# EAGLE design Arduino CAN Dev Board (EAGLE 6.4)
DESCRIPTION: microOBD 200 OBD-II Module; HW_REV: 1.4; PCB_REV: C; PCB_SPEC1: Layer Count: 4; PCB_SPEC2: Size: 1.3" x 0.59"; PCB_SPEC3: Finish Thickness: 0.049" - 0.052"; PCB_SPEC4: Copper Weight: 1oz; TITLE: STM1120

## Sheet 1 of 2
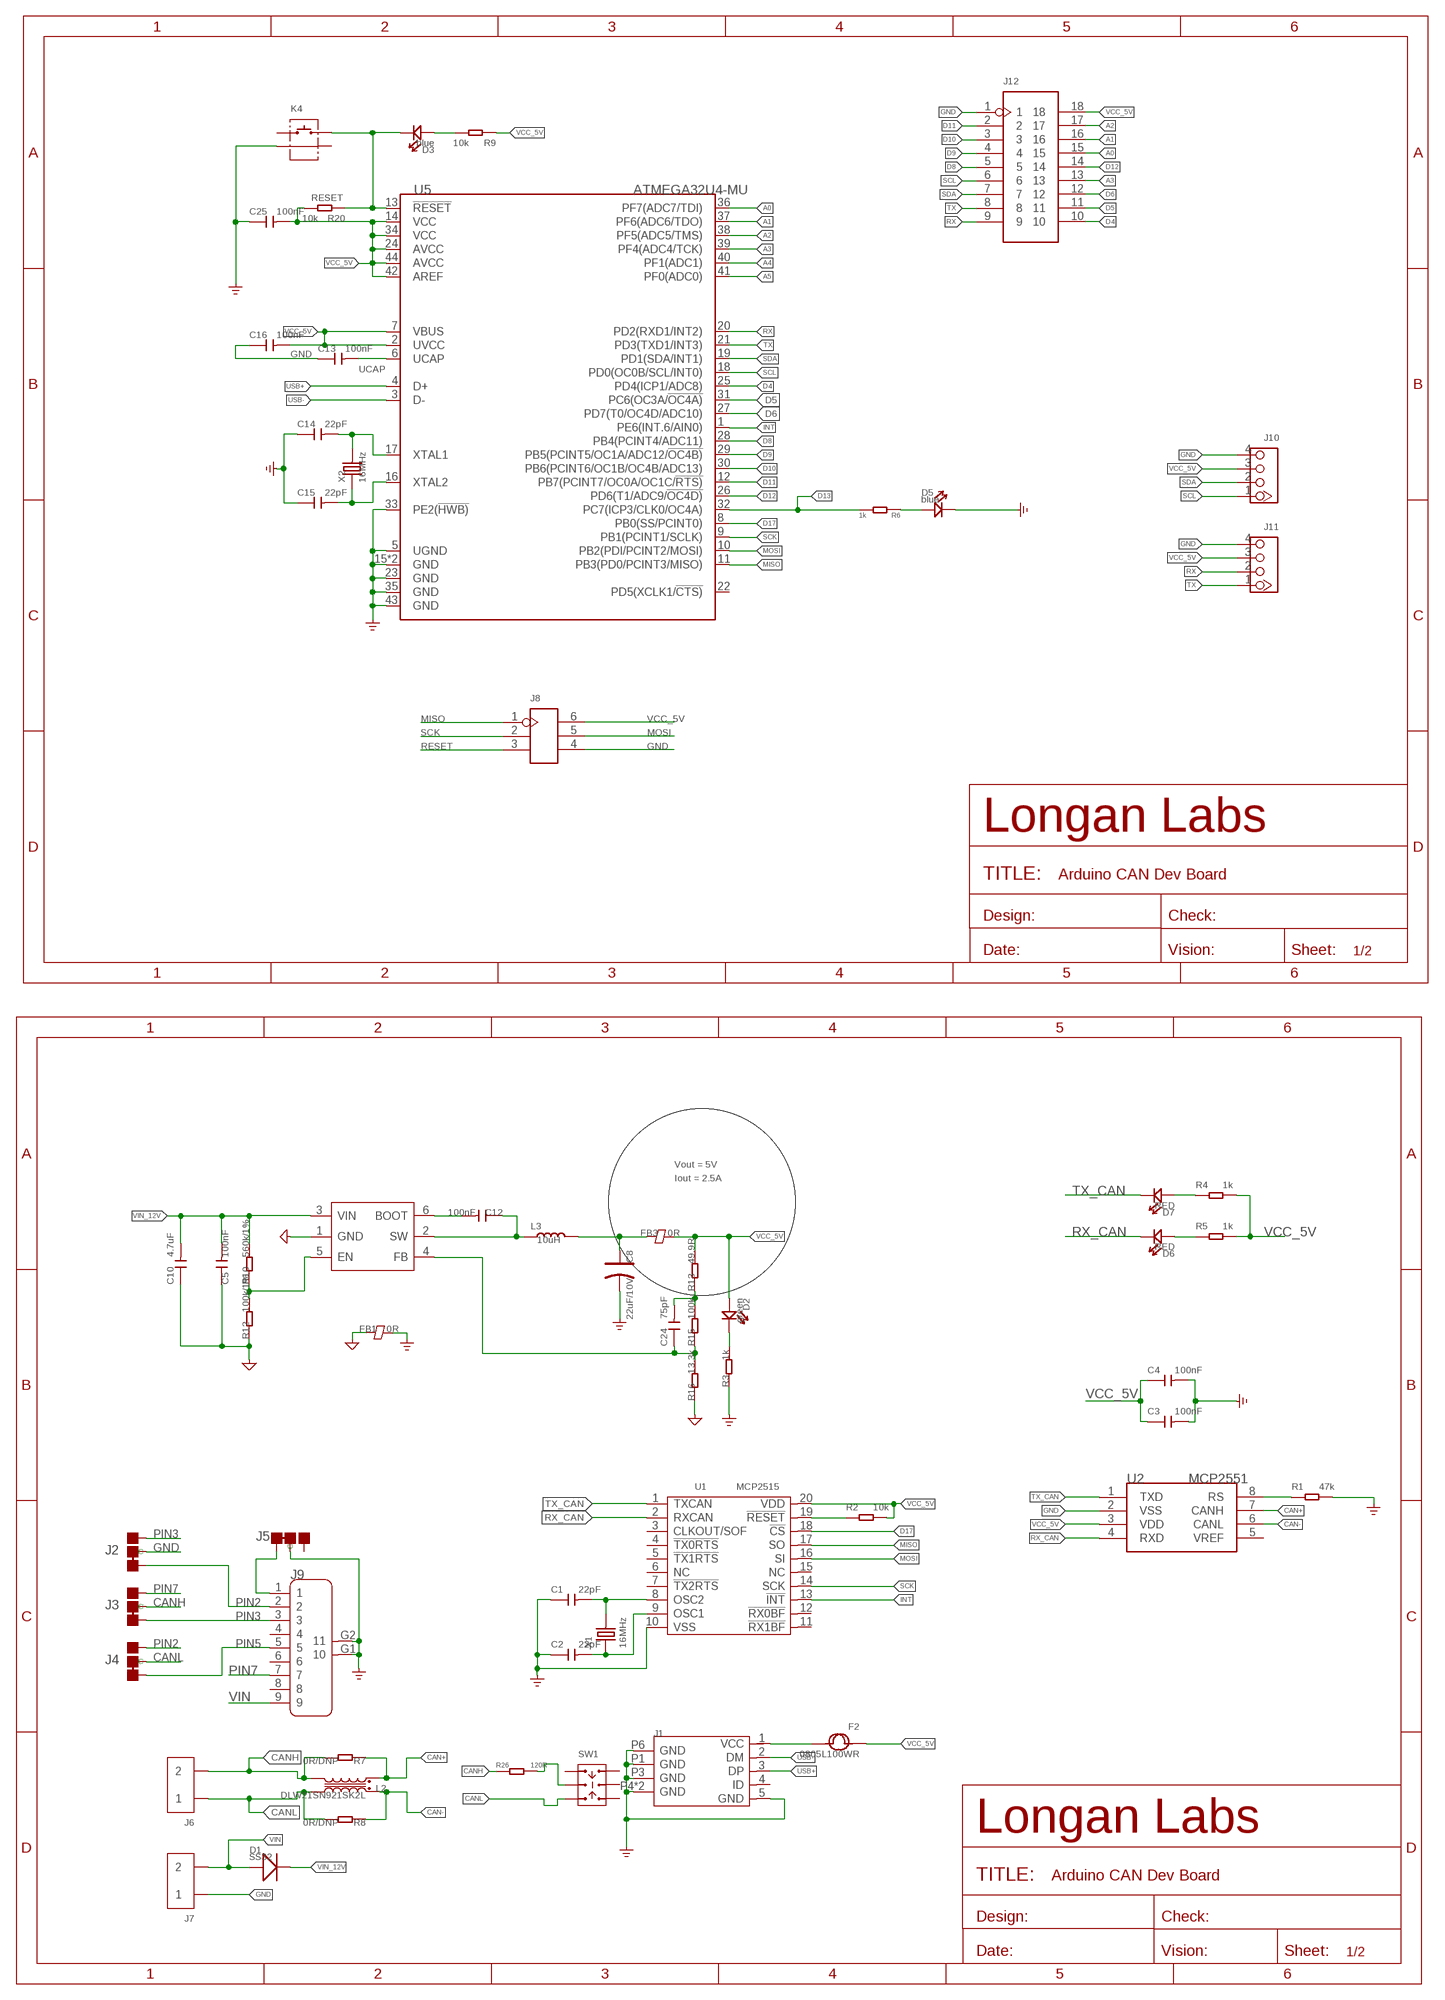
[diagram p0: schematic, sheet 1]

### Parts
C1  22pF  CAP-0603  [C0603]
C2  22pF  CAP-0603  [C0603]
C3  100nF  CAP-0603  [C0603]
C4  100nF  CAP-0603  [C0603]
C5  100nF  CAP-0603  [C0603]
C8  22uF/10V  CAP-POLAR-AVX-B  [AVX-B]
C10  4.7uF  CAP-1206  [C1206]
C12  100nF  CAP-0603  [C0603]
C13  100nF  CAP-0603  [C0603]
C14  22pF  CAP-0603  [C0603]
C15  22pF  CAP-0603  [C0603]
C16  100nF  CAP-0603  [C0603]
C24  75pF  CAP-0603  [C0603]
C25  100nF  CAP-0603  [C0603]
D1  SS32  DIODE'SMA'  [DO-214AC]
D2  green  LED'0603'  [LED-0603]
D3  blue  LED'0603'  [LED-0603]
D5  blue  LED'0603'  [LED-0603]
D6  RED  LED'0603'  [LED-0603]
D7  RED  LED'0603'  [LED-0603]
F2  0805L100WR  FUSE0805  [F0805]
FB1  0R  FERRITE-BEAD-0805  [F0805]
FB3  0R  FERRITE-BEAD-0805  [F0805]
J1  MICRO-USB5+4P-320010050  [MICRO-USB5+5P-SMD-0.65-7.2X5.06MM]
J2  JUMPER-3P-SHORT  [3P-SMD-SHORT]
J3  JUMPER-3P-SHORT  [3P-SMD-SHORT]
J4  JUMPER-3P-SHORT  [3P-SMD-SHORT]
J5  JUMPER-3P-SHORT  [3P-SMD-SHORT]
J6  SCREW-TERMINAL-2P'5.08'  [H2-5.0-10.5X8.0MM]
J7  SCREW-TERMINAL-2P'5.08'  [H2-5.0-10.5X8.0MM]
J8  HEADER-2X3P-2.54  [H2X3-2.54]
J9  DB9'MEAL'  [DB9-MEAL]
J10  320110033  GROVE-CONNECTOR-DIP-2.0  [HW4-2.0]
J11  320110033  GROVE-CONNECTOR-DIP-2.0  [HW4-2.0]
J12  HEADER-2X9P-2.54  [H2X9-2.54]
K4  BUTTON-2+2P  [SW2+2P-7.7X2.75X3.95MM]
L2  DLW21SN921SK2L  INDUCTOR-COMMON-MODE-SRF2012-900YA  [INT4-0.85-2X1.25X1.2MM]
L3  10uH  INDUCTOR-6.6X7.1  [INT2-SMD-6.6X7.1X3MM]
R1  47k  RES-0603  [R0603]
R2  10k  RES-0603  [R0603]
R3  1k  RES-0603  [R0603]
R4  1k  RES-0603  [R0603]
R5  1k  RES-0603  [R0603]
R6  1k  RES-0603  [R0603]
R7  0R/DNP  RES-0603  [R0603]
R8  0R/DNP  RES-0603  [R0603]
R9  10k  RES-0603  [R0603]
R10  560k/1%  RES-0603  [R0603]
R12  100k/1%  RES-0603  [R0603]
R13  49.9R  RES-0603  [R0603]
R15  100k  RES-0603  [R0603]
R16  13.3k  RES-0603  [R0603]
R20  10k  RES-0603  [R0603]
R26  120R  RES-0603  [R0603]
SW1  SWITCH-2CH-6P-311010004  [SW6-2.54-9.0X3.5X3.2+2.0MM]
U1  MCP2515  MCP2515'ST'  [TSSOP20-0.65-6.5X4.4MM]
U2  MCP2551  MCP2551-SOIC8  [SOIC8-6.0]
U5  ATMEGA32U4-MU  [QFN44]
U$11  PMIC-TPS54302  [SOT-23-6]
X1  16MHz  CRYSTAL-2P'5032'  [X2-SMD-5.0X3.2X1.3MM]
X2  16MHz  CRYSTAL'5032'  [2P-SMD-5X3.2]

### Nets
A0: J12.15 U5.36(PF7(ADC7/TDI))
A1: J12.16 U5.37(PF6(ADC6/TDO))
A2: J12.17 U5.38(PF5(ADC5/TMS))
A3: J12.13 U5.39(PF4(ADC4/TCK))
A4: U5.40(PF1(ADC1))
A5: U5.41(PF0(ADC0))
AGND: C5.1 C10.1 FB1.1 R12.1 R16.1 U$11.1(GND) ; supply symbol labelled GND_SIGNAL
CAN+: L2.4 R7.1 U2.7(CANH)
CAN-: L2.1 R8.1 U2.6(CANL)
CANH: J3.MM(C) J6.2 L2.3 R7.2 R26.1
CANL: J4.MM(C) J6.1 L2.2 R8.2 SW1.CH1B
D4: J12.10 U5.25(PD4(ICP1/ADC8))
D5: J12.11 U5.31(PC6(OC3A/!OC4A))
D6: J12.12 U5.27(PD7(T0/OC4D/ADC10))
D8: J12.5 U5.28(PB4(PCINT4/ADC11))
D9: J12.4 U5.29(PB5(PCINT5/OC1A/ADC12/!OC4B))
D10: J12.3 U5.30(PB6(PCINT6/OC1B/OC4B/ADC13))
D11: J12.2 U5.12(PB7(PCINT7/OC0A/OC1C/!RTS))
D12: J12.14 U5.26(PD6(T1/ADC9/!OC4D))
D13: R6.2 U5.32(PC7(ICP3/CLK0/OC4A))
D17: U1.18(!CS) U5.8(PB0(SS/PCINT0))
EXT_PWR: F2.2 J1.1(VCC)
GND: C1.1 C2.1 C3.2 C4.2 C8.- C13.1 C14.1 C15.1 C16.1 C25.1 D5.- FB1.2 J1.5(GND) J1.P1(GND) J1.P3(GND) J1.P4(GND) J1.P5(GND) J1.P6(GND) J2.MM(C) J5.MM(C) J7.1 J8.4 J9.G1 J9.G2 J10.4 J11.4 J12.1 K4.S1 R1.2 R3.1 U1.10(VSS) U2.2(VSS) U5.5(UGND) U5.15(GND) U5.23(GND) U5.33(PE2(!HWB)) U5.35(GND) U5.43(GND) U5.TAB(GND) ; supply symbol labelled GND_POWER
INT: U1.13(!INT) U5.1(PE6(INT.6/AIN0))
MISO: J8.1 U1.17(SO) U5.11(PB3(PD0/PCINT3/MISO))
MOSI: J8.5 U1.16(SI) U5.10(PB2(PDI/PCINT2/MOSI))
N$1: D2.- R3.2
N$2: D7.+ R4.1
N$3: D3.+ R9.2
N$4: R10.1 R12.2 U$11.5(EN)
N$5: R26.2 SW1.COM1
N$6: C14.2 U5.17(XTAL1) X2.2
N$8: D5.+ R6.1
N$11: C12.1 L3.1 U$11.2(SW)
N$12: C15.2 U5.16(XTAL2) X2.1
N$13: J5.11(L) J9.1
N$14: C12.2 U$11.6(BOOT)
N$15: D6.+ R5.1
N$16: C1.2 U1.8(OSC2) X1.2
N$17: C2.2 U1.9(OSC1) X1.1
N$19: C8.+ FB3.1 L3.2
N$20: R1.1 U2.8(RS)
N$23: C24.2 R13.1 R15.2
N$26: C24.1 R15.1 R16.2 U$11.4(FB)
PIN2: J2.11(L) J4.00(R) J9.2
PIN3: J2.00(R) J3.11(L) J9.3
PIN5: J4.11(L) J9.5
PIN7: J3.00(R) J9.7
RESET: D3.- J8.3 K4.2 R20.1 U5.13(!RESET)
RST_N: R2.1 U1.19(!RESET)
RX: J11.2 J12.9 U5.20(PD2(RXD1/INT2))
RX_CAN: D6.- U1.2(RXCAN) U2.4(RXD)
SCK: J8.2 U1.14(SCK) U5.9(PB1(PCINT1/SCLK))
SCL: J10.1 J12.6 U5.18(PD0(OC0B/SCL/INT0))
SDA: J10.2 J12.7 U5.19(PD1(SDA/INT1))
TX: J11.1 J12.8 U5.21(PD3(TXD1/INT3))
TX_CAN: D7.- U1.1(TXCAN) U2.1(TXD)
UCAP: C13.2 U5.6(UCAP)
USB+: J1.3(DP) U5.4(D+)
USB-: J1.2(DM) U5.3(D-)
VCC_5V: C3.1 C4.1 C16.2 C25.2 D2.+ F2.1 FB3.2 J8.6 J10.3 J11.3 J12.18 R2.2 R4.2 R5.2 R9.1 R13.2 R20.2 U1.20(VDD) U2.3(VDD) U5.2(UVCC) U5.7(VBUS) U5.14(VCC) U5.24(AVCC) U5.34(VCC) U5.42(AREF) U5.44(AVCC)
VIN: D1.1(+) J7.2 J9.9
VIN_12V: C5.2 C10.2 D1.2(-) R10.2 U$11.3(VIN)
Unconnected: J1.4(ID) J5.00(R) J9.4 J9.6 J9.8 K4.1 K4.S2 SW1.CH1A SW1.CH2A SW1.CH2B SW1.COM2 U1.3(CLKOUT/SOF) U1.4(!TX0RTS) U1.5(!TX1RTS) U1.6(NC) U1.7(!TX2RTS) U1.11(!RX1BF) U1.12(!RX0BF) U1.15(NC) U2.5(VREF) U5.22(PD5(XCLK1/!CTS))

### Notes on the sheet
- Vout = 5V
- Iout = 2.5A

## Sheet 2 of 2

## Library data of the parts
C1-C5 C10 C12-C16 C24 C25 = Discrete-new:CAP: Ceramic Capacitors
C8 = Discrete-new:CAP-POLAR: Electrolytic Capacitors,Tantalum Capacitors and Super Capacitors
D1 = Discrete-new:DIODE*
D2 D3 D5-D7 = Discrete-new:LED
F2 = Discrete-small:FUSE
FB1 FB3 = Discrete-new:FERRITE-BEAD
J1 = Connector-new:MICRO-USB5+4P: 320010137:MICRO USB B型DIP 沉板0.7无卷边 -ST-USB-01H2 320010000:MICRO USB 5F CCHT 6.45(0.8X0.9) -ST-USB-001G 320010050:USB-MC-001-05 320010025:MICRO USB 5S AB TYPE DIP7.2
J2-J5 = Discrete-new:JUMPER-3P-SHORT
J6 J7 = Connector-new:SCREW-TERMINAL-2P: 2P-3.5:320110028;2P-5.0:320110031
J8 = Connector-new:HEADER-2X3P
J9 = Connector:DB9
J10 J11 = Connector-new:GROVE-CONNECTOR-DIP: 4P-2.0:320110033;4P-2.0-90D:320110034
J12 = Connector-new:HEADER-2X9P
K4 = Connector-new:BUTTON-2+2P
L2 = Discrete-new:INDUCTOR-COMMON-MODE
L3 = Discrete-new:INDUCTOR
R1-R10 R12 R13 R15 R16 R20 R26 = Discrete-new:RES
SW1 = Switch:SWITCH-2CH-6P
U1 = Heilight:MCP2515
U2 = IC:MCP2551: High-Speed CAN Transceiver http://ww1.microchip.com/downloads/en/devicedoc/21667f.pdf
U5 = IC:ATMEGA32U4: 8-bit Microcontroller With 16/32K Bytes of ISP Flash and USB controller
U$11 = IC-new:PMIC-TPS54302
X1 = Discrete-new:CRYSTAL-2P
X2 = Discrete:CRYSTAL*: CRYSTAL

## Net classes
0 default: width 0.152 mm, clearance 0.152 mm
3 usbvcc: width 0.152 mm, drill 0.152 mm, clearance 0.152 mm

## Board
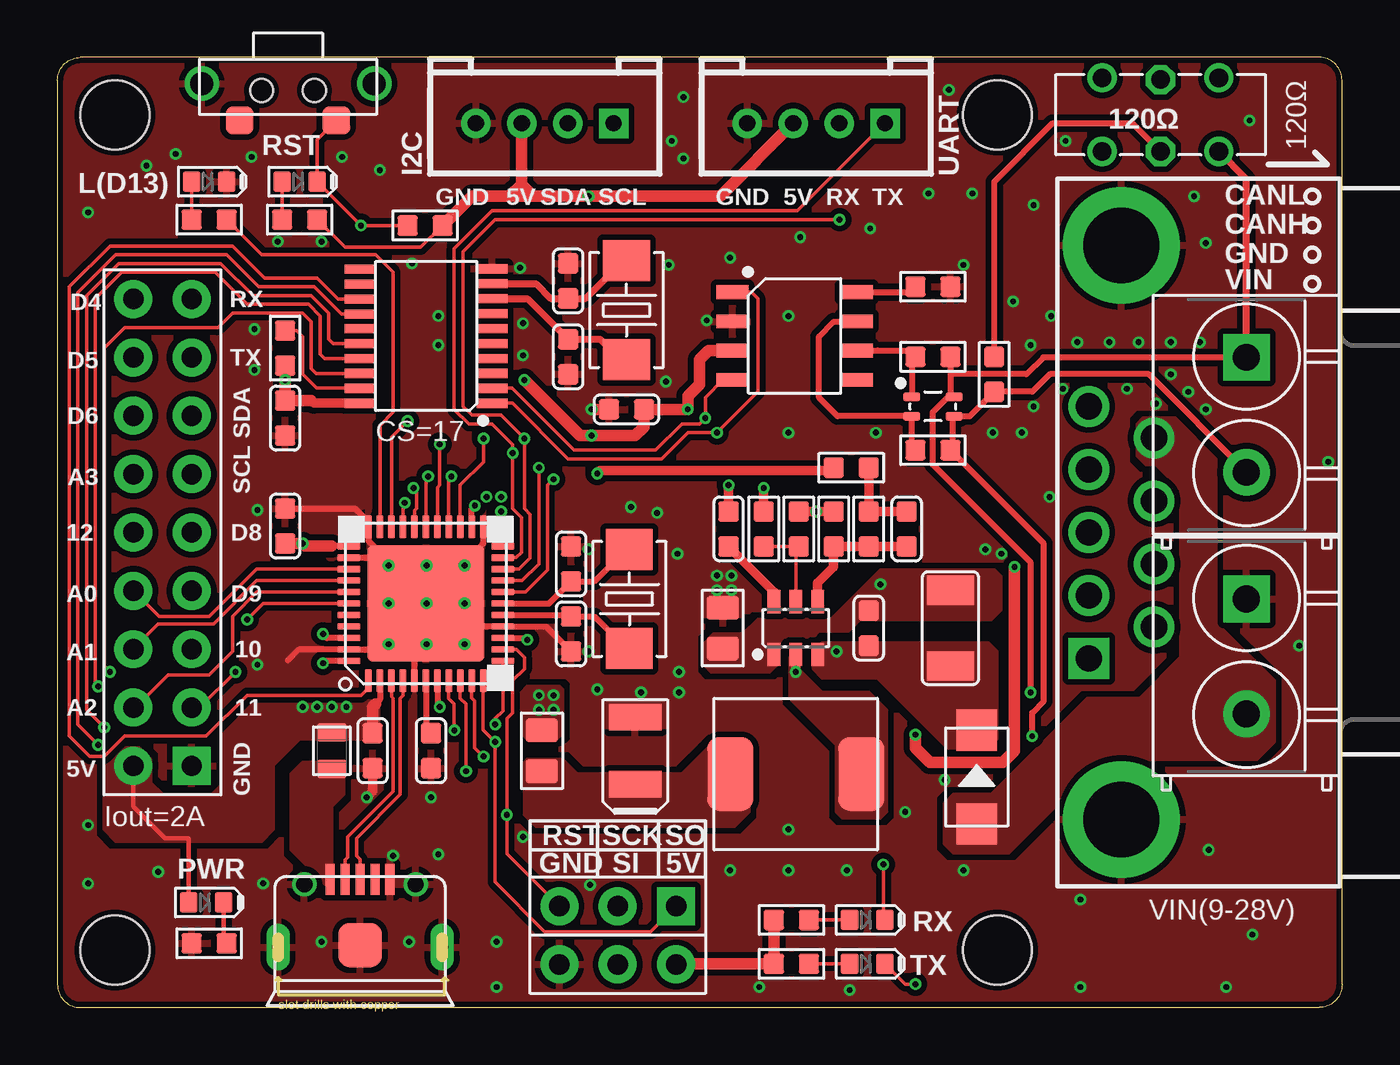
[diagram p1: board, top side]
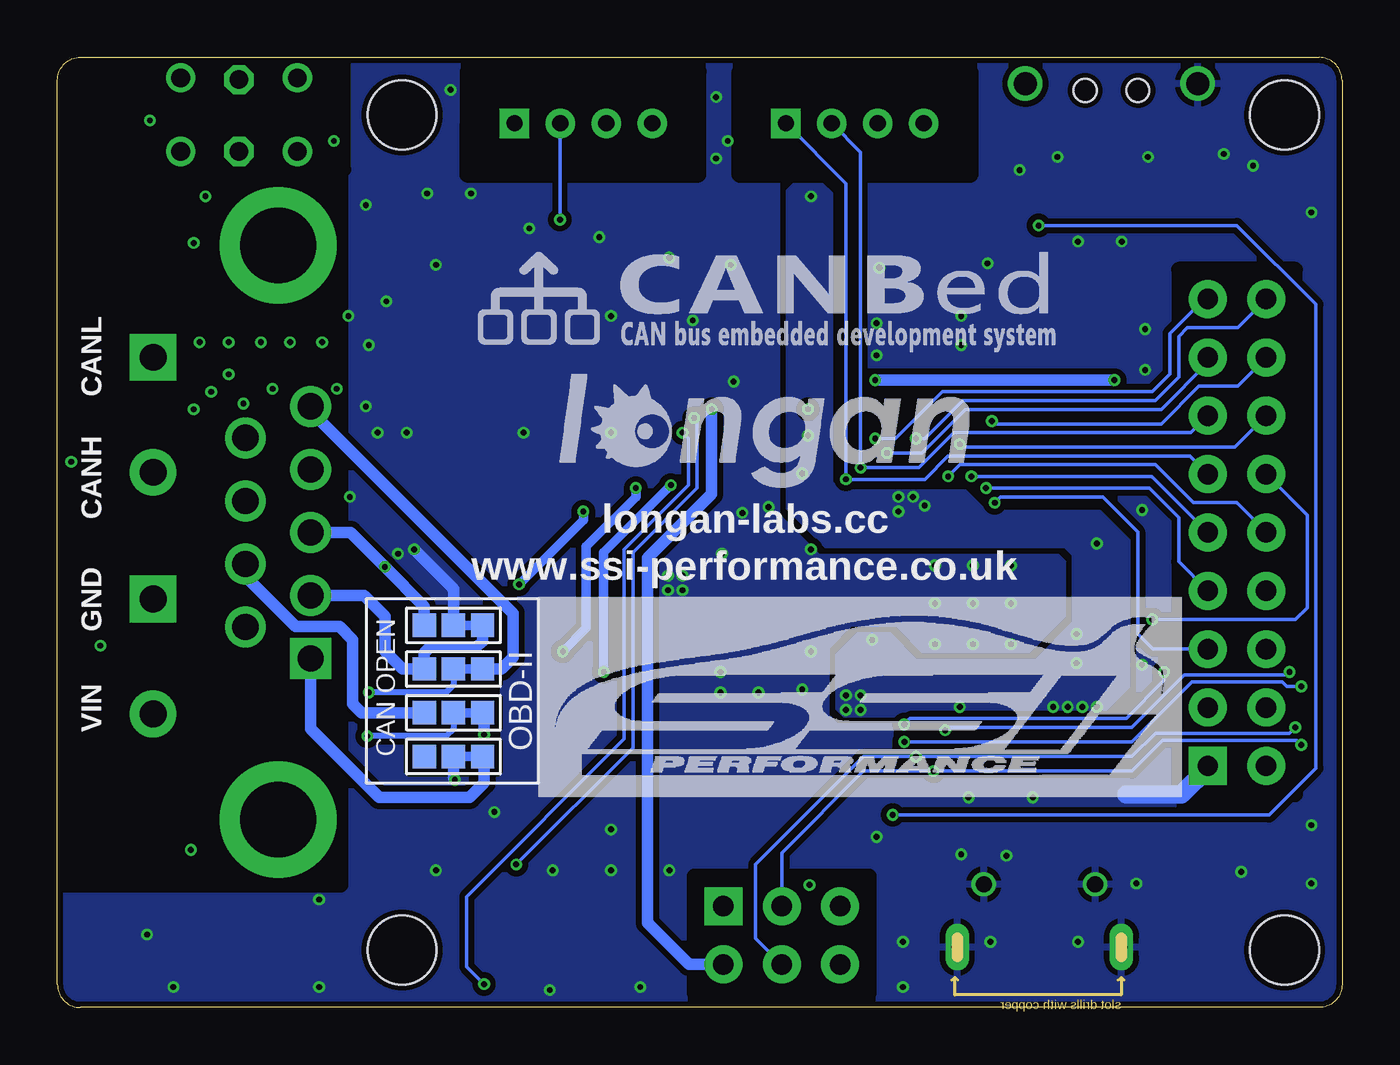
[diagram p2: board, bottom side, seen from below]

Size 55.91 x 41.35 mm. Coordinates in mm from the lower left corner, seen from the top.
Outline: 1,0 54.91,0 arc90 55.91,1 55.91,40.35 arc84 55.01,41.35 1,41.35 arc90 0,40.35 0,1 arc90 1,0
Copper layers (1*16): Top 0.035mm / dielectric 1.5mm / Bottom 0.035mm
Design rules "SeeedStudio_2layer_DRU_no_angle_20140221 *": minimum track width 1mil, minimum drill 10mil, track to track 6mil, track to pad 6mil, pad to pad 6mil, via to via 6mil, smd to smd 0mil, copper to edge 10mil, drill to drill 10mil, minimum pad ring 4mil, minimum via ring 4mil, stop-mask expansion 2mil, vias tented up to drill 25mil, thermal gap 10mil
Holes 3 mm at 2.5,38.85 2.5,2.5 40.91,38.85 40.91,2.5
bRestrict: area 16.2,36.3 to 26.2,40.7; area 28,36.2 to 38.1,40.7; area 2,9.3 to 7.1,32.1; area 43.6,5.3 to 55.8,36.1; area 20.6,0.6 to 28.2,5.7; area 43.4,36.5 to 52.6,41.3

### Footprints (pad centres in the part's own frame; a part is rotated, then mirrored left to right if it is on the bottom)
C0603 = smd 0.889 x 0.889: 1 -0.762,0; 2 0.762,0
AVX-B = smd 1.143 x 2.286: + 1.46,0; - -1.46,0
C1206 = smd 1.27 x 2.032: 1 -1.651,0; 2 1.651,0
DO-214AC = smd 1.8 x 1.77: 1 -2.042,0; 2 2.042,0
LED-0603 = smd 0.762 x 0.889: + 0.762,0; - -0.762,0
F0805 = smd 0.819 x 1.27: 1 -0.79,0; 2 0.79,0
F0805' = smd 1.016 x 1.397: 1 -0.889,0; 2 0.889,0
MICRO-USB5+5P-SMD-0.65-7.2X5.06MM = smd 0.4 x 1.35: 1 -1.3,2.875; 2 -0.65,2.875; 3 0,2.875; 4 0.65,2.875; 5 1.3,2.875 | smd 1.9 x 1.9: P1 0,0 | drill 0.508 pad 1.016 long: P3 -3.575,-0.08; P4 3.575,-0.08 | drill 0.7: P5 -2.425,2.65; P6 2.425,2.65
3P-SMD-SHORT = smd 1.016 x 1.016: 00 -1.27,0; 11 1.27,0; MM 0,0
H2-5.0-10.5X8.0MM = drill 1.168 pad 2.032 square: 1 0,2.5 | drill 1.168 pad 2.032: 2 0,-2.5
H2X3-2.54 = drill 0.889 pad 1.651 square: 1 -1.27,2.54 | drill 0.889 pad 1.651: 2 -1.27,0; 3 -1.27,-2.54; 4 1.27,-2.54; 5 1.27,0; 6 1.27,2.54
DB9-MEAL = drill 1.143 pad 1.778 square: 1 -5.486,1.422 | drill 1.143 pad 1.778: 2 -2.743,1.422; 3 0,1.422; 4 2.743,1.422; 5 5.486,1.422; 6 -4.115,-1.422; 7 -1.372,-1.422; 8 1.372,-1.422; 9 4.115,-1.422 | drill 3.302 pad 5.08: G1 12.497,0; G2 -12.497,0
HW4-2.0 = drill 0.7 pad 1.27 square: 1 -3,0 | drill 0.7 pad 1.27: 2 -1,0; 3 1,0; 4 3,0
H2X9-2.54 = drill 0.889 pad 1.651 square: 1 -1.27,10.16 | drill 0.889 pad 1.651: 2 -1.27,7.62; 3 -1.27,5.08; 4 -1.27,2.54; 5 -1.27,0; 6 -1.27,-2.54; 7 -1.27,-5.08; 8 -1.27,-7.62; 9 -1.27,-10.16; 10 1.27,-10.16; 11 1.27,-7.62; 12 1.27,-5.08; 13 1.27,-2.54; 14 1.27,0; 15 1.27,2.54; 16 1.27,5.08; 17 1.27,7.62; 18 1.27,10.16
SW2+2P-7.7X2.75X3.95MM = smd 1.2 x 1.2: 1 -2.1,0; 2 2.1,0 | drill 1 pad 1.5: S1 -3.75,1.6; S2 3.75,1.6 | hole 1: -1.15,1.3; 1.15,1.3
INT4-0.85-2X1.25X1.2MM = smd 0.4 x 0.75: 1 -0.425,-0.925; 2 -0.425,0.925; 3 0.425,0.925; 4 0.425,-0.925
INT2-SMD-6.6X7.1X3MM = smd 2 x 3.2: 1 -2.85,0; 2 2.85,0
R0603 = smd 0.889 x 0.889: 1 -0.762,0; 2 0.762,0
SW6-2.54-9.0X3.5X3.2+2.0MM = drill 0.813 pad 1.27: CH1A -2.54,-1.6; CH1B 2.54,-1.6; CH2A -2.54,1.6; CH2B 2.54,1.6 | drill 0.813 pad 1.27 octagon: COM1 0,-1.6; COM2 0,1.524
TSSOP20-0.65-6.5X4.4MM = smd 0.4 x 1.35: 1 -2.925,-2.875; 2 -2.275,-2.875; 3 -1.625,-2.875; 4 -0.975,-2.875; 5 -0.325,-2.875; 6 0.325,-2.875; 7 0.975,-2.875; 8 1.625,-2.875; 9 2.275,-2.875; 10 2.925,-2.875; 11 2.91,2.875; 12 2.26,2.875; 13 1.61,2.875; 14 0.96,2.875; 15 0.325,2.875; 16 -0.325,2.875; 17 -0.975,2.875; 18 -1.625,2.875; 19 -2.275,2.875; 20 -2.925,2.875
SOIC8-6.0 = smd 0.6 x 1.4: 1 -1.905,-2.7; 2 -0.635,-2.7; 3 0.635,-2.7; 4 1.905,-2.7; 5 1.905,2.7; 6 0.635,2.7; 7 -0.635,2.7; 8 -1.905,2.7
QFN44 = smd 1 x 0.3: 1 -3.35,2.5; 2 -3.35,2; 3 -3.35,1.5; 4 -3.35,1; 5 -3.35,0.5; 6 -3.35,0; 7 -3.35,-0.5; 8 -3.35,-1; 9 -3.35,-1.5; 10 -3.35,-2; 11 -3.35,-2.5; 23 3.35,-2.5; 24 3.35,-2; 25 3.35,-1.5; 26 3.35,-1; 27 3.35,-0.5; 28 3.35,0; 29 3.35,0.5; 30 3.35,1; 31 3.35,1.5; 32 3.35,2; 33 3.35,2.5 | smd 0.3 x 1: 12 -2.5,-3.35; 13 -2,-3.35; 14 -1.5,-3.35; 15 -1,-3.35; 16 -0.5,-3.35; 17 0,-3.35; 18 0.5,-3.35; 19 1,-3.35; 20 1.5,-3.35; 21 2,-3.35; 22 2.5,-3.35; 34 2.5,3.35; 35 2,3.35; 36 1.5,3.35; 37 1,3.35; 38 0.5,3.35; 39 0,3.35; 40 -0.5,3.35; 41 -1,3.35; 42 -1.5,3.35; 43 -2,3.35; 44 -2.5,3.35 | smd 5.08 x 5.08: TAB 0,0
SOT-23-6 = smd 0.55 x 1.016: 1 -0.95,-1.143; 2 0,-1.143; 3 0.95,-1.143; 4 0.95,1.143; 5 0,1.143; 6 -0.95,1.143
X2-SMD-5.0X3.2X1.3MM = smd 1.778 x 2.032: 1 -2.159,0; 2 2.159,0
2P-SMD-5X3.2 = smd 1.778 x 2.032: 1 -2.159,0; 2 2.159,0

### Placement (x,y rotation side)
C1  22.22,28.32 90 top
C2  22.22,31.62 270 top
C3  24.76,26.04 180 top
C4  9.91,25.65 270 top
C5  35.31,16.51 270 top
C8  25.15,11.18 270 top
C10  38.86,16.51 270 top
C12  29.21,20.83 270 top
C13  16.26,11.18 90 top
C14  22.35,19.3 270 top
C15  22.35,16.26 90 top
C16  13.72,11.18 90 top
C24  36.96,20.83 90 top
C25  9.91,20.95 270 top
D1  40,10.03 90 top
D2  6.48,4.57 180 top
D3  10.54,35.94 180 top
D5  6.6,35.94 180 top
D6  35.24,3.81 180 top
D7  35.24,1.91 180 top
F2  11.94,11.18 270 top
FB1  0R  [F0805']  28.96,16.51 90 top
FB3  0R  [F0805']  21.08,11.18 90 top
J1  13.17,2.71 0 top
J2  38.67,16.64 0 bottom
J3  38.67,12.83 0 bottom
J4  38.67,14.73 0 bottom
J5  38.67,10.92 0 bottom
J6  51.75,25.8 0 top
J7  51.75,15.28 0 top
J8  24.38,3.14 270 top
J9  46.31,20.68 90 top
J10  21.21,38.48 180 top
J11  33.02,38.48 180 top
J12  4.57,20.68 180 top
K4  10.03,38.61 0 top
L2  38.1,26.16 270 top
L3  32.13,10.16 180 top
R1  38.1,31.37 0 top
R2  9.91,28.7 270 top
R3  6.6,2.79 0 top
R4  31.94,1.91 180 top
R5  31.94,3.81 180 top
R6  6.6,34.29 0 top
R7  38.1,24.26 0 top
R8  38.1,28.32 0 top
R9  10.54,34.29 180 top
R10  30.73,20.83 90 top
R12  32.26,20.83 270 top
R13  34.54,23.5 180 top
R15  35.31,20.83 90 top
R16  33.78,20.83 270 top
R20  16,34.04 0 top
R26  40.77,27.56 90 top
SW1  48.01,38.86 0 top
U1  16.05,29.22 90 top
U2  32.08,29.23 270 top
U5  16.03,17.58 90 top
U$11  32.13,16.51 0 top
U$12  [LONGAN-SILK-SMALL]  35.68,21.16 0 bottom
X1  24.76,30.35 270 top
X2  24.89,17.78 90 top

### Tracks (layer width: path | path; a pad name or v marks a point on that pad's centre or on a via)
A0
  Top 0.152: U5.36 8.66,19.08 6.6,17.02 4.42,17.02 J12.15
A1
  Top 0.152: U5.37 8.67,18.58 6.79,16.7 4.38,16.7 3.3,15.62 J12.16
A2
  Top 0.152: U5.38 8.68,18.08 7.62,17.02 7.62,15.49 6.6,14.48 4.83,14.48 3.4,13.05 J12.17
A3  (via drill 0.25 pad 0.51)
  Top 0.152: U5.39 8.94,17.58 v8.25,16.89
  Bottom 0.152: v8.25,16.89 2.03,16.89 1.52,17.4 1.52,21.44 J12.13
AGND  (via drill 0.25 pad 0.51)
  Top 0.406: R16.1 v33.02,21.59 R12.1
  Bottom 0.406: v33.02,21.59 33.02,21.21 v35.81,18.41
  pour Top (isolate 0.254, no thermals): 40.77,19.05 35.81,19.05 33.66,16.89 30.48,16.89 29.84,16.26 28.55,16.26 28.19,15.9 28.19,14.86 28.45,14.6 30.99,14.6 31.37,14.99 31.37,15.88 31.62,16.13 32.89,16.13 33.15,16.38 34.42,16.38 34.92,16.89 40.64,16.89 41.15,17.4 41.15,18.67
CAN+
  Top 0.254: R7.1 37.17,24.42 L2.4 33.95,25.74 33.15,26.54 33.15,29.21 33.78,29.84 34.77,29.84 U2.7
CAN-
  Top 0.254: 37.19,28.59 37.21,28.57 37.21,28.45 | L2.1 37.21,26.62 37.21,28.19 R8.1 37.21,28.45 | U2.6 35.69,28.59 | 35.69,28.59 37.07,28.59 37.21,28.45 | 35.69,28.57 35.69,28.59
CANH  (via drill 0.25 pad 0.51)
  Top 0.254: v42.42,11.81 42.42,12.83 42.93,13.34 42.93,20.19 R7.2 38.94,24.34 38.94,25.74 L2.3 39.71,25.74 R26.1 42.42,26.8 43.18,27.56 47.5,27.56 51.75,23.31 J6.2
  Bottom 0.254: J3.MM 38.67,12.13 38.99,11.81 v42.42,11.81
CANL  (via drill 0.25 pad 0.51)
  Top 0.254: v42.35,13.72 42.35,19.37 38.1,23.62 38.1,25.91 38.78,26.59 L2.2 38.86,26.75 38.86,27.56 | R8.2 38.86,27.56 | J6.1 42.9,28.3 42.16,27.56 38.86,27.56
  Top 0.305: J6.1 51.75,36.06 SW1.CH1B
  Bottom 0.254: J4.MM 38.67,14.03 38.99,13.72 v42.35,13.72
D4  (via drill 0.25 pad 0.51)
  Top 0.152: U5.25 17.53,22.74 18.54,23.75 v18.54,24.77
  Bottom 0.152: J12.10 4.55,29.59 6.73,29.59 7.11,29.21 7.11,27.43 8.13,26.42 16.51,26.42 18.16,24.77 v18.54,24.77
D5  (via drill 0.25 pad 0.51)
  Top 0.152: U5.31 14.53,24.82 v15.24,25.53
  Bottom 0.152: J12.11 4.55,27.05 6.22,27.05 7.87,25.4 15.11,25.4 v15.24,25.53
D6  (via drill 0.25 pad 0.51)
  Top 0.152: U5.27 16.53,22.63 16.64,22.73 v16.64,24.51
  Bottom 0.152: J12.12 4.67,24.38 16.51,24.38 v16.64,24.51
D8  (via drill 0.25 pad 0.51)
  Top 0.152: U5.28 16.03,23.02 v16.13,23.11
  Bottom 0.152: v16.13,23.11 8.28,23.11 J12.5
D9  (via drill 0.25 pad 0.51)
  Top 0.152: U5.29 15.53,21.63 15.62,21.72 15.62,22.48 v15.49,22.61
  Bottom 0.152: v15.49,22.61 8.38,22.61 7.11,21.34 7.11,19.41 J12.4
D10  (via drill 0.25 pad 0.51)
  Top 0.152: U5.30 15.03,21.89 v15.11,21.97
  Bottom 0.152: J12.3 8.23,15.59 8.89,16.26 8.89,20.7 10.41,22.23 14.86,22.23 v15.11,21.97
D11  (via drill 0.25 pad 0.51)
  Top 0.152: J12.2 6.2,13.05 v7.75,14.6 | U5.12 19.38,12.91 19.05,12.57 v19.05,12.32
  Bottom 0.152: v7.75,14.6 7.75,14.22 9.4,12.57 18.8,12.57 v19.05,12.32
D12  (via drill 0.25 pad 0.51)
  Top 0.152: U5.26 17.03,23 v17.14,23.11
  Bottom 0.152: J12.14 3.3,20.7 4.57,21.97 6.48,21.97 8.13,23.62 16.64,23.62 v17.14,23.11
D13
  Top 0.152: U5.32 14.03,25.34 14.6,25.91 14.6,32 13.84,32.77 8.89,32.77 R6.2
D17  (via drill 0.25 pad 0.51)
  Top 0.152: U1.18 11.26,27.6 11.05,27.81 11.05,29.84 10.67,30.23 7.62,30.23 6.98,29.59 2.92,29.59 2.03,28.7 2.03,14.86 v2.29,14.6 | U5.8 17.03,13.45 17.27,13.21 v17.27,12.06
  Bottom 0.152: v2.29,14.6 2.41,14.48 6.86,14.48 9.14,12.19 17.14,12.19 v17.27,12.06
EXT_PWR
  pour Top (isolate 0.254, no thermals): 11.81,5.21 10.16,6.86 10.16,10.16 10.67,10.67 12.19,10.67 12.45,10.41 12.45,9.27 11.94,8.76 11.94,5.33
GND  (via drill 0.25 pad 0.51)
  Top 0.254: v14.41,15.81 14.18,15.58 U5.43 10.5,15.58 10.03,15.11 | U5.5 15.53,15.28 v16.06,15.81 | v17.72,15.81 18.48,16.58 U5.15 21.27,16.58 C15.1 | U5.23 18.53,20.18 17.72,19.37 v17.72,19.24 | C25.1 12.95,21.72 13.53,21.14 U5.33 13.53,20.31 13.97,19.88 13.97,19.58 | U5.35 13.97,19.58 | 13.97,19.58 14.08,19.58 v14.41,19.24
  Top 0.406: C16.1 13.72,9.4 v13.46,9.14
  Top 0.508: C3.2 v23.24,26.04
  Bottom 0.508: J5.MM 38.67,9.97 v38.61,9.91 | J2.MM 38.67,18.22 v40.39,19.94
  Bottom 0.813: J12.1 5.84,10.41 6.98,9.27 9.4,9.27
  other vias: 16.26,9.14 29.34,18.16 28.7,18.16 28.7,18.8 29.34,18.8 25.4,13.72 27.05,13.72 27.05,14.6 23.49,13.84 23.11,15.49 23.11,19.94 14.6,6.6 16.07,17.59 17.72,17.59 14.41,17.59 16.07,19.24 8.7,21.65 8.57,27.75 8.57,29.53 9.59,33.34 11.49,33.34 20.13,32.19 20.26,29.78 20.26,28.38 26.48,27.24 28.26,29.91 26.61,32.32 39.43,32.32 38.8,39.94 26.99,19.75 26.1,21.53 24.96,21.78 12.38,37.02 8.45,37.02 5.14,37.15 3.87,36.64 1.33,34.61 1.33,7.94 1.33,5.4 4.38,5.91 8.95,5.4 11.49,2.86 15.3,2.86 19.11,2.86 16.57,6.67 20.26,7.43 19.11,0.89 30.54,0.89 34.48,0.76 44.51,0.89 44.51,4.7 39.43,5.97 36.89,8.51 34.35,5.97 31.81,5.97 29.27,5.97 31.81,7.75 23.18,5.33 50.1,6.86 50.86,0.89 52.01,3.17 54.04,15.75 55.31,23.75 49.97,33.27 49.47,35.31 51.88,38.61 43.88,37.72 42.48,34.92 39.81,35.43 35.37,33.91 32.32,33.53 31.81,30.1 31.81,25.02 35.62,25.02 29.27,32.64 27.24,36.96 26.73,37.72 14.03,36.45 15.43,32.38 16.57,28.83 16.57,30.1 43.24,30.1 41.59,30.73 40.7,25.02 41.97,25.02 49.72,28.96 8.7,14.92 41.08,19.75 43.18,22.23 37.91,35.43 27.24,39.62 48.45,27.56 47.05,28.96 45.78,28.96 44.39,28.96 42.35,28.83 42.48,26.16 43.75,26.92 46.55,26.92 47.82,26.29 49.97,26.04 48.45,28.96 49.21,26.8
  pour Top (isolate 0.254, no thermals): 28.07,17.02 29.72,17.02 29.97,17.27 29.97,18.67 29.59,19.05 27.18,19.05 26.29,18.16 26.29,14.6 26.03,14.35 23.11,14.35 22.61,13.84 22.61,12.45 22.86,12.19 27.43,12.19 27.69,12.45 27.69,16.64
  pour Bottom (isolate 0.254, no thermals): 51.31,18.54 54.48,18.54 54.99,18.03 54.99,7.62 53.34,5.97 45.21,5.97 44.58,6.6 44.58,9.02 45.34,9.78 51.94,9.78 53.09,10.92 53.09,14.6 51.05,16.64 51.05,18.29
  pour Top (isolate 0.254, rank 6): -0.64,41.91 56.51,41.91 56.51,-0.63 -0.64,-0.63
  pour Bottom (isolate 0.254, rank 6): -0.64,41.91 56.51,41.91 56.51,-0.63 -0.64,-0.63
INT
  Top 0.152: U1.13 12.22,30.83 11.3,31.75 9.02,31.75 7.62,33.15 2.29,33.15 0.51,31.37 0.51,11.81 1.4,10.92 2.03,10.92 2.92,11.81 6.48,11.81 8.25,13.59 13.21,13.59 13.53,13.91 U5.1
MISO  (via drill 0.25 pad 0.51)
  Top 0.152: U1.17 11.63,28.25 11.43,28.45 11.43,30.1 10.92,30.61 8.25,30.61 6.86,32 2.79,32 1.65,30.86 1.65,14.1 v1.78,13.97 | U5.11 18.53,12.07 v19.05,11.56 19.05,5.46 21.21,3.3 25.81,3.3 J8.1
  Bottom 0.152: v1.78,13.97 2.41,13.97 2.6,14.16 6.54,14.16 9.14,11.56 v19.05,11.56
MOSI  (via drill 0.25 pad 0.51)
  Top 0.152: U1.16 11.99,28.9 11.81,29.08 11.81,30.23 11.05,30.99 8.51,30.99 7.11,32.38 2.67,32.38 1.27,30.99 1.27,12.95 v2.03,12.19 | U5.10 18.03,13.46 18.16,13.34 18.16,11.3 v18.54,10.92
  Bottom 0.152: v2.03,12.19 2.29,11.94 8.13,11.94 9.14,10.92 v18.54,10.92 20.83,10.92 25.53,6.22 25.53,3.02 J8.5
N$1
  Top 0.203: D2.- 7.24,2.92 R3.2
N$2
  Top 0.152: D7.+ R4.1
N$3
  Top 0.152: D3.+ R9.2
N$4
  Top 0.152: U$11.5 32.13,19.94 R12.2 R10.1
N$5
  Top 0.254: R26.2 40.77,35.94 43.31,38.48 46.79,38.48 SW1.COM1
N$6
  Top 0.254: U5.17 21.39,17.58 C14.2 23.37,18.54 24.76,19.94 X2.2
N$8
  Top 0.152: D5.+ R6.1
N$11  (via drill 0.25 pad 0.51)
  Top 0.406: U$11.2 v32.13,14.6 | C12.1 v29.21,22.73
  Bottom 0.406: v32.13,14.6 32.13,19.81 v29.21,22.73
  pour Top (isolate 0.254, no thermals): 32.13,15.37 32.26,15.24 32.26,14.73 33.27,13.72 35.31,13.72 36.07,12.95 36.07,8.51 35.81,8.26 34.16,8.26 33.91,8.51 33.91,11.43 31.88,13.46 31.88,15.24 32,15.37
N$12
  Top 0.254: U5.16 22.29,17.08 C15.2 23.37,17.02 24.76,15.62 X2.1
N$13
  Bottom 0.508: J5.11 37.34,10.86 37.34,9.78 37.97,9.14 41.91,9.14 44.88,12.12 J9.1
N$14
  Top 0.406: U$11.6 31.18,18.09 C12.2
N$15
  Top 0.152: D6.+ R5.1
N$16
  Top 0.305: U1.8 20.46,30.85 C1.2 23.62,29.08 24.51,28.19 X1.2
N$17
  Top 0.305: U1.9 20.82,31.5 21.46,30.86 C2.2 22.99,30.86 24.64,32.51 X1.1
N$19
  pour Top (isolate 0.254, no thermals): 29.84,11.56 28.57,11.56 27.18,10.16 22.61,10.16 21.97,10.8 20.45,10.8 20.32,10.67 20.32,8.38 20.83,7.87 29.46,7.87 30.1,8.51 30.1,11.3
N$20
  Top 0.254: U2.8 37.1,31.13 R1.1
N$23
  Top 0.406: C24.2 R15.2 R13.1
N$26
  Top 0.406: U$11.4 33.08,18.48 33.78,19.18 R16.2 35.18,20.07 35.31,19.94 R15.1 C24.1
PIN2
  Bottom 0.508: J2.11 37.4,15.94 37.66,15.68 39.69,15.68 39.94,15.43 J4.00 40.89,14.73 41.66,15.49 41.66,17.02 42.57,17.93 J9.2
PIN3  (via drill 0.25 pad 0.51)
  Top 0.508: v41.66,19.18 41.66,11.18 41.15,10.67 37.97,10.67 37.34,11.3 v37.34,11.87
  Bottom 0.508: J2.00 39.94,17.46 v41.66,19.18 43.15,20.68 J9.3 | v37.34,11.87 37.34,12.76 J3.11
PIN5
  Bottom 0.508: J4.11 36.58,14.73 36.07,15.24 36.07,17.14 44.88,25.96 J9.5
PIN7
  Bottom 0.508: J9.7 47.73,18.77 45.53,16.57 43.62,16.57 43.05,16 43.05,13.21 42.67,12.83 J3.00
RESET  (via drill 0.25 pad 0.51)
  Top 0.152: U5.13 19.98,15.58 20.32,15.24 20.32,14.73 19.81,14.22 19.81,12.83 19.56,12.57 v19.56,8.38 19.56,6.7 J8.3 | R20.1 v13.21,34.04 D3.- 11.3,37.78 K4.2
  Bottom 0.152: v13.21,34.04 4.57,34.04 1.14,30.61 1.14,10.41 3.17,8.38 v19.56,8.38
RST_N
  Top 0.152: U1.19 11.28,26.95 10.67,27.56 10.67,29.21 10.41,29.46 R2.1
RX  (via drill 0.25 pad 0.51)
  Top 0.152: U5.20 20.09,19.08 20.57,19.56 20.57,21.46 20.32,21.72 v20.32,24.77 19.3,25.78 18.03,25.78 17.65,26.16 17.65,32.89 19.05,34.29 v34.04,34.29
  Bottom 0.152: J12.9 5.99,30.84 7.49,29.34 7.49,27.56 8.25,26.8 17.4,26.8 19.43,24.77 v20.32,24.77 | v34.04,34.29 34.04,38.47 J11.2
RX_CAN  (via drill 0.25 pad 0.51)
  Top 0.152: U1.2 19.79,26.95 22.48,24.26 26.03,24.26 27.18,25.4 27.94,25.4 v28.19,25.65 28.19,26.54 28.97,27.32 U2.4 | v35.94,6.22 35.94,3.87 D6.-
  Bottom 0.152: v35.94,6.22 30.86,11.3 30.86,19.81 28.07,22.61 28.07,25.53 v28.19,25.65
SCK  (via drill 0.25 pad 0.51)
  Top 0.152: U1.14 12.36,30.18 11.18,31.37 8.76,31.37 7.37,32.77 2.54,32.77 0.89,31.11 0.89,12.32 v1.78,11.43 | U5.9 17.53,13.45 17.78,13.21 v17.78,10.29
  Bottom 0.152: v1.78,11.43 1.97,11.62 7.81,11.62 9.14,10.29 v17.78,10.29 20.83,10.29 24.38,6.73 J8.2
SCL  (via drill 0.25 pad 0.51)
  Top 0.152: U5.18 20.36,18.08 21.34,19.05 21.34,22.73 v21.59,22.99
  Bottom 0.152: J12.6 6.63,24 17.14,24 18.16,22.99 v21.59,22.99 21.59,35.86 J10.1
SDA  (via drill 0.25 pad 0.51)
  Top 0.152: U5.19 20.23,18.58 20.95,19.3 v20.95,23.5
  Bottom 0.152: J12.7 6.58,25.02 16.89,25.02 18.41,23.5 v20.95,23.5 20.95,37.23 J10.2
TX  (via drill 0.25 pad 0.51)
  Top 0.152: U5.21 19.96,19.58 20.19,19.81 20.19,21.34 19.81,21.72 v19.81,24.13 19.81,24.51 18.92,25.4 17.91,25.4 17.27,26.04 17.27,33.02 18.92,34.67 32.21,34.67 J11.1
  Bottom 0.152: J12.8 5.84,28.07 7.87,26.04 16.38,26.04 18.29,24.13 v19.81,24.13
TX_CAN  (via drill 0.25 pad 0.51)
  Top 0.152: U1.1 19.8,26.3 22.22,23.88 26.29,23.88 27.43,25.02 v28.7,25.02 30.48,26.8 30.48,30.86 30.21,31.13 U2.1 | v37.34,1.02 36.89,1.02 D7.-
  Bottom 0.152: v28.7,25.02 28.45,24.77 28.45,22.73 31.24,19.94 31.24,11.68 38.1,4.83 38.1,1.78 v37.34,1.02
UCAP
  Top 0.254: U5.6 16.03,12.16 C13.2
USB+
  Top 0.152: U5.4 15.03,13.57 14.92,13.46 14.92,9.27 13.02,7.37 13.02,6.6 13.17,6.45 J1.3
USB-
  Top 0.152: U5.3 14.53,13.53 14.6,13.46 14.6,9.4 12.64,7.43 12.64,6.54 12.52,6.42 J1.2
VCC_5V  (via drill 0.25 pad 0.51)
  Top 0.152: R9.1 12.51,33.08 15.81,33.08 R20.2
  Top 0.203: D2.+ 5.71,7.37 4.7,7.37 3.3,8.76 3.3,10.41 | 3.3,10.41 3.17,10.54 3.17,10.67 3.3,10.54 3.3,10.41
  Top 0.254: U5.2 14.03,13.4 13.84,13.21 | U5.7 16.53,13.19 v16.64,13.08 | U5.14 20.37,16.08 v20.45,16 | U5.24 18.03,21.72 v18.16,21.84 | U5.34 11.93,20.08 | U5.42 11.73,16.08 v11.56,16.26 | U5.44 11.65,15.08 v11.56,14.99
  Top 0.406: v23.49,23.24 23.62,23.37 33.66,23.37 R13.2 | U1.20 11.16,26.3 11.05,26.42
  Top 0.508: 13.84,13.21 13.72,13.08 C16.2 | 11.93,20.08 10.78,20.08 v10.67,20.19 C25.2 | J10.3 20.21,35.32 20.19,35.31 | 20.7,35.31 v23.11,35.31 28.84,35.31 J11.3 | 20.7,35.31 20.19,35.31 | 20.19,35.31 19.68,35.31 | 19.68,35.31 18.03,35.31 R20.2 | 19.68,35.31 20.19,35.81 20.7,35.31 | 11.05,26.42 C4.1 v9.91,27.3 R2.2 | v20.32,27.3 22.73,24.89 v23.24,24.89 25.15,24.89 25.53,25.27 C3.1 v27.43,26.04 27.43,26.61 27.94,27.11 27.94,28.19 28.34,28.59 U2.3 | R5.2 R4.2 26.96,1.91 J8.6
  Bottom 0.508: v9.91,27.3 v20.32,27.3 | J8.6 28.41,1.87 30.23,3.68 30.23,19.56 27.43,22.35 v27.43,26.04
  other vias: 12.57,13.08 11.94,13.08 11.3,13.08 10.67,13.08 20.95,12.95 20.95,13.59 21.59,13.59 21.59,12.95 19.3,21.59 18.67,22.23 19.3,22.23
  pour Top (isolate 0.254, no thermals): 13.59,11.68 10.54,11.68 9.4,10.54 9.4,7.75 8.89,7.24 2.54,7.24 2.03,7.75 2.03,10.41 2.92,11.3 3.56,11.3 4.06,10.8 4.06,9.78 4.57,9.27 6.73,9.27 7.24,9.78 7.24,11.94 8.64,13.34 13.84,13.34 13.97,13.21 13.97,12.06
  pour Top (isolate 0.254, no thermals): 21.84,13.97 20.45,13.97 20.19,13.72 20.19,11.94 20.45,11.68 21.72,11.68 21.97,11.94 21.97,13.84
  pour Bottom (isolate 0.254, no thermals): 21.97,15.37 21.97,12.98 21.69,12.7 10.54,12.7 9.27,13.97 9.27,20.32 10.54,21.59 15.49,21.59 16.38,22.48 21.84,22.48 22.22,22.86 22.22,35.43 22.61,35.81 23.88,35.81 24.13,35.56 24.13,21.72 22.48,20.07 12.06,20.07 11.68,19.68 11.68,16.76 13.33,15.11 18.54,15.11 19.68,16.26 21.08,16.26
VIN
  pour Top (isolate 0.254, no thermals): 47.24,25.65 48.64,25.65 50.42,23.88 50.42,16.76 52.96,14.22 52.96,11.56 52.2,10.8 45.47,10.8 41.4,6.73 38.99,6.73 38.61,7.11 38.61,8.89 38.99,9.27 40.64,9.27 44.83,13.46 47.1,13.46 48.89,15.26 48.89,22.53 47.8,23.62 47.37,23.62 46.99,24 46.99,25.4
VIN_12V  (via drill 0.25 pad 0.51)
  Top 0.406: R10.2 v30.73,22.61
  Bottom 0.406: v30.73,22.61 30.73,22.23 32.89,20.07 32.89,16.51 v33.91,15.49
  pour Top (isolate 0.254, no thermals): 38.73,11.3 40.51,11.3 40.89,11.68 40.89,15.49 40.51,15.88 33.27,15.88 32.89,15.49 32.89,14.73 33.27,14.35 35.69,14.35

### Text on the board
tPlace: 120Ω | RST | 120Ω | I2C | UART | L(D13) | GND | 5V | SDA | SCL | GND | 5V | RX | TX | CANL | CANH | GND | VIN | D4 | RX | D5 | TX | D6 | SDA | CS=17 | A3 | SCL | 12 | D8 | D9 | A0 | 10 | A1 | 11 | A2 | GND | 5V | Iout=2A | RST | SCK | SO | PWR | GND | SI | 5V | RX | VIN(9-28V) | TX
bPlace: CANL | CANH | longan-labs.cc | GND | www.ssi-performance.co.uk | VIN | OBD-II | CAN OPEN